# EAGLE design dip18_a1 (EAGLE 5.11)
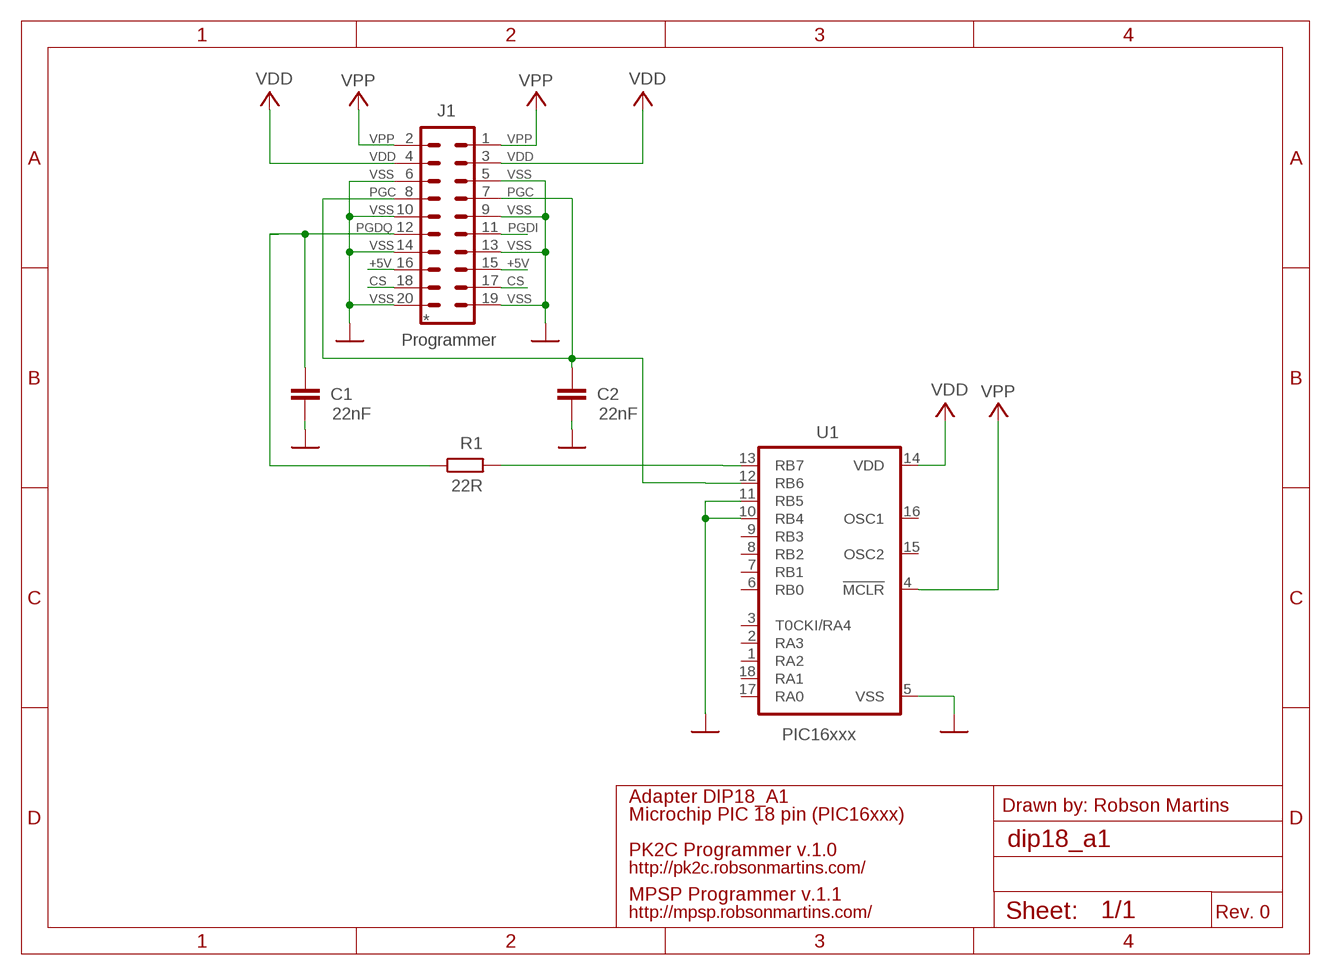
[diagram p0: schematic, sheet 1]

## Parts
C1  22nF  C-EU025-025X050  [C025-025X050]
C2  22nF  C-EU025-025X050  [C025-025X050]
J1  Programmer  MA10-2  [MA10-2]
R1  22R  R-EU_0204/7  [0204/7]
U1  PIC16xxx  PIC16F84AP  [DIL18]

## Nets
+5V: J1.15 J1.16
CS: J1.17 J1.18
GND: C1.2 C2.2 J1.5 J1.6 J1.9 J1.10 J1.13 J1.14 J1.19 J1.20 U1.5(VSS) U1.10(RB4) U1.11(RB5)
PGC: C2.1 J1.7 J1.8 U1.12(RB6)
PGD: C1.1 J1.12 R1.1
PGD_CHIP: R1.2 U1.13(RB7)
PGDI: J1.11
VDD: J1.3 J1.4 U1.14(VDD)
VPP: J1.1 J1.2 U1.4(!MCLR)
Unconnected: U1.1(RA2) U1.2(RA3) U1.3(T0CKI/RA4) U1.6(RB0) U1.7(RB1) U1.8(RB2) U1.9(RB3) U1.15(OSC2) U1.16(OSC1) U1.17(RA0) U1.18(RA1)

## Notes on the sheet
- VPP | VPP
- VDD | VDD
- VSS | VSS
- PGC | PGC
- VSS | VSS
- PGDQ | PGDI
- VSS | VSS
- +5V | +5V
- CS | CS
- VSS | VSS
- *
- Adapter DIP18_A1
- Drawn by: Robson Martins
- Microchip PIC 18 pin (PIC16xxx)
- PK2C Programmer v.1.0
- http://pk2c.robsonmartins.com/
- MPSP Programmer v.1.1
- http://mpsp.robsonmartins.com/ | Rev. 0

## Library data of the parts
C1 C2 = rcl:C-EU: CAPACITOR, European symbol
J1 = con-lstb:MA10-2: PIN HEADER; OC_FARNELL: unknown; OC_NEWARK: unknown
R1 = resistor:R-EU_: RESISTOR, European symbol
U1 = microchip:PIC16F8*: MICROCONTROLLER 8-Bit PIC16F8X Family - CMOS Flash/EEPROM Pin Compatible : PIC16F83, PIC16CR83, PIC16F84A, PIC16CR84 see also PIC16C* <DEVICE:PIC16C*>; MF: MICROCHIP; MPN: PIC16F84A-04I/P; OC_FARNELL: 9760865; OC_NEWARK: 69K7635

## Board
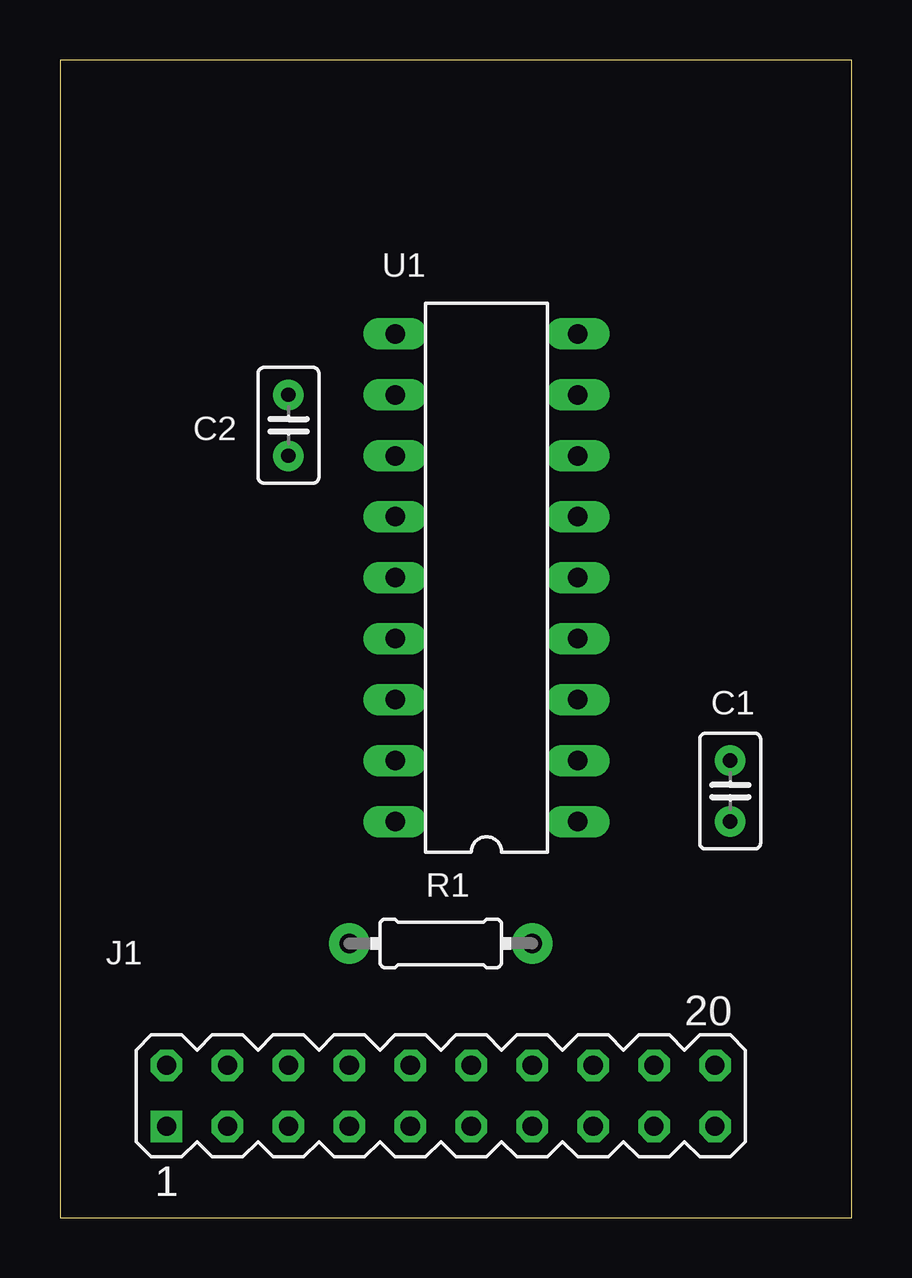
[diagram p1: board, top side]
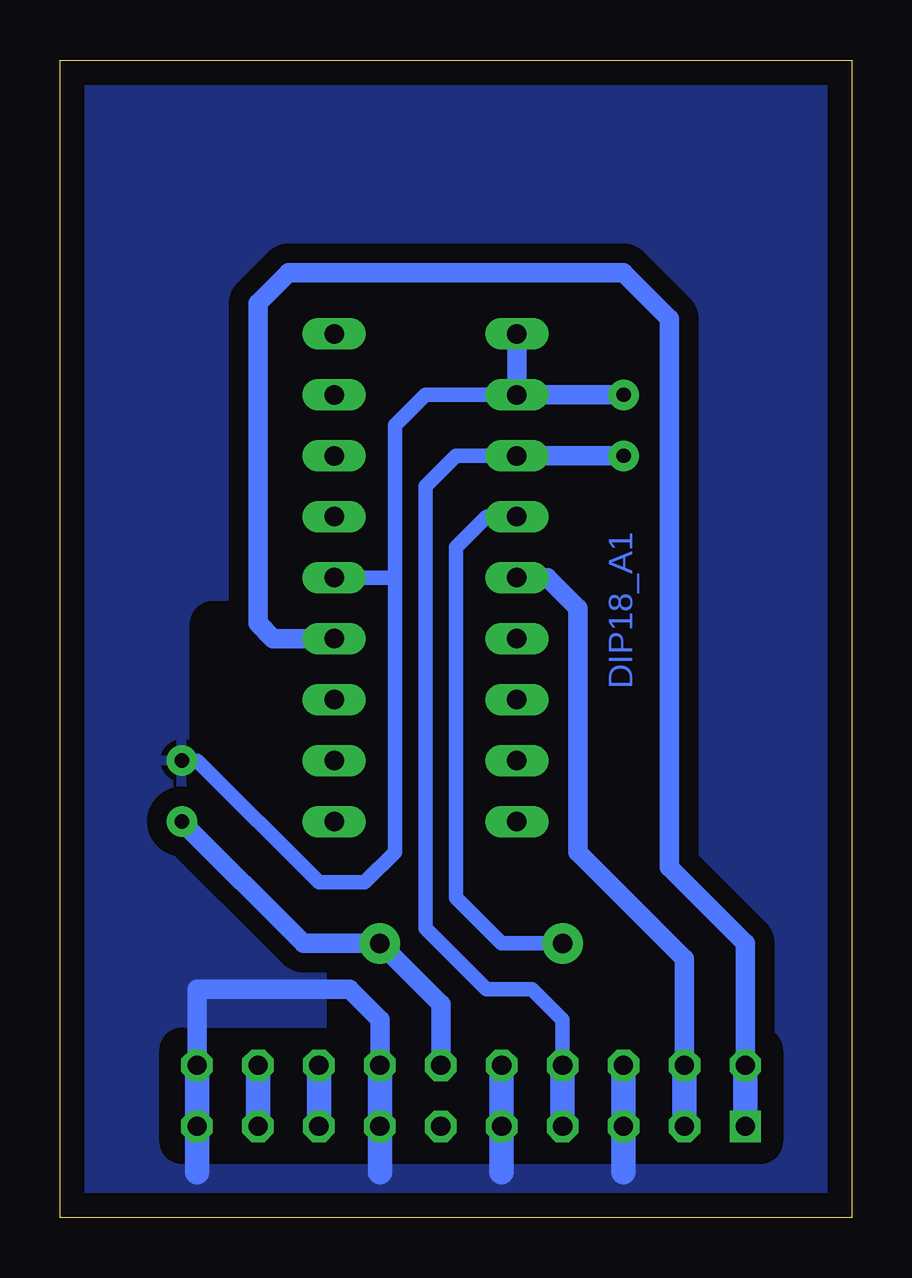
[diagram p2: board, bottom side, seen from below]

Size 33.02 x 48.24 mm. Coordinates in mm from the lower left corner, seen from the top.
Outline: 33.02,0 33.02,48.24 0,48.24 0,0 33.02,0
Copper layers (1*16): Top 0.035mm / dielectric 1.5mm / Bottom 0.035mm
Design rules "default": minimum track width 10mil, minimum drill 24mil, track to track 8mil, track to pad 8mil, pad to pad 8mil, via to via 8mil, smd to smd 8mil, copper to edge 40mil, drill to drill 8mil, minimum pad ring 10mil, minimum via ring 8mil, stop-mask expansion 4mil, vias tented up to drill 0mil, thermal gap 10mil
bRestrict: area 3.8,3.2 to 27.9,12.1; area 9.5,13.3 to 26.7,38.1

### Footprints (pad centres in the part's own frame; a part is rotated, then mirrored left to right if it is on the bottom)
C025-025X050 = drill 0.6 pad 1.27 round: 1 -1.27,0; 2 1.27,0
MA10-2 = drill 0.8 pad 1.27 square: 1 -11.43,-1.27 | drill 0.8 pad 1.27 octagon: 2 -11.43,1.27; 3 -8.89,-1.27; 4 -8.89,1.27; 5 -6.35,-1.27; 6 -6.35,1.27; 7 -3.81,-1.27; 8 -3.81,1.27; 9 -1.27,-1.27; 10 -1.27,1.27; 11 1.27,-1.27; 12 1.27,1.27; 13 3.81,-1.27; 14 3.81,1.27; 15 6.35,-1.27; 16 6.35,1.27; 17 8.89,-1.27; 18 8.89,1.27; 19 11.43,-1.27; 20 11.43,1.27
0204/7 = drill 0.813 pad 1.676 round: 1 -3.81,0 | drill 0.8 pad 1.676 round: 2 3.81,0
DIL18 = drill 0.813 long: 1 -10.16,-3.81; 2 -7.62,-3.81; 3 -5.08,-3.81; 4 -2.54,-3.81; 5 0,-3.81; 6 2.54,-3.81; 7 5.08,-3.81; 8 7.62,-3.81; 9 10.16,-3.81; 10 10.16,3.81; 11 7.62,3.81; 12 5.08,3.81; 13 2.54,3.81; 14 0,3.81; 15 -2.54,3.81; 16 -5.08,3.81; 17 -7.62,3.81; 18 -10.16,3.81

### Placement (x,y rotation side)
C1  27.94,17.78 90 top
C2  9.53,33.02 90 top
J1  15.88,5.08 0 top
R1  15.88,11.43 180 top
U1  17.78,26.67 90 top

### Tracks (layer width: path | path; a pad name or v marks a point on that pad's centre or on a via)
+5V
  Bottom 1.016: J1.15 J1.16
CS
  Bottom 1.016: J1.17 J1.18
GND
  Bottom 0.61: U1.5 19.69,26.67 19.05,26.67 | U1.11 17.78,34.29 19.05,33.02 19.05,27.3 19.05,26.67 | 19.05,26.67 19.05,15.24 20.32,13.97 22.23,13.97 27.31,19.05 C1.2
  Bottom 0.813: J1.14 19.69,8.26 20.96,9.53 27.31,9.53 J1.20 | U1.10 U1.11 C2.2
  Bottom 1.016: J1.6 J1.5 9.53,1.91 | J1.10 J1.9 14.61,1.91 | J1.14 J1.13 19.69,1.91 | J1.20 J1.19 27.31,1.91
  pour Bottom (isolate 0.813): 33.02,0 0,0 0,48.26 33.02,48.26
PGC
  Bottom 0.61: J1.8 12.07,8.26 13.34,9.53 15.24,9.53 16.51,10.79 17.78,12.06 17.78,30.48 16.51,31.75 U1.12
  Bottom 0.813: U1.12 C2.1
  Bottom 1.016: J1.7 J1.8
PGD
  Bottom 0.813: J1.12 17.15,8.89 R1.1 22.86,11.43 C1.1
PGD_CHIP
  Bottom 0.61: R1.2 14.61,11.43 16.51,13.34 16.51,27.94 15.24,29.21 U1.13
VDD
  Bottom 0.813: J1.4 6.99,7.62 6.99,10.79 11.43,15.24 11.43,25.4 12.7,26.67 U1.14
  Bottom 1.016: J1.3 J1.4
VPP
  Bottom 0.813: J1.1 4.45,7.62 4.45,8.89 4.45,11.43 7.62,14.61 7.62,37.47 9.53,39.37 23.5,39.37 24.77,38.1 24.77,24.77 24.13,24.13 U1.4
  Bottom 1.016: J1.1 J1.2

### Text on the board
Bottom: DIP18_A1
tDocu: Microchip PIC | PIC 16xxx | DIP18_A1 | Adapter | VSS | VPP | VDD | VSS | PGC | VSS | PGD | VSS | +5V | CS